# EAGLE schematic WP75xx 2 no usb_v (EAGLE 7.7.0)
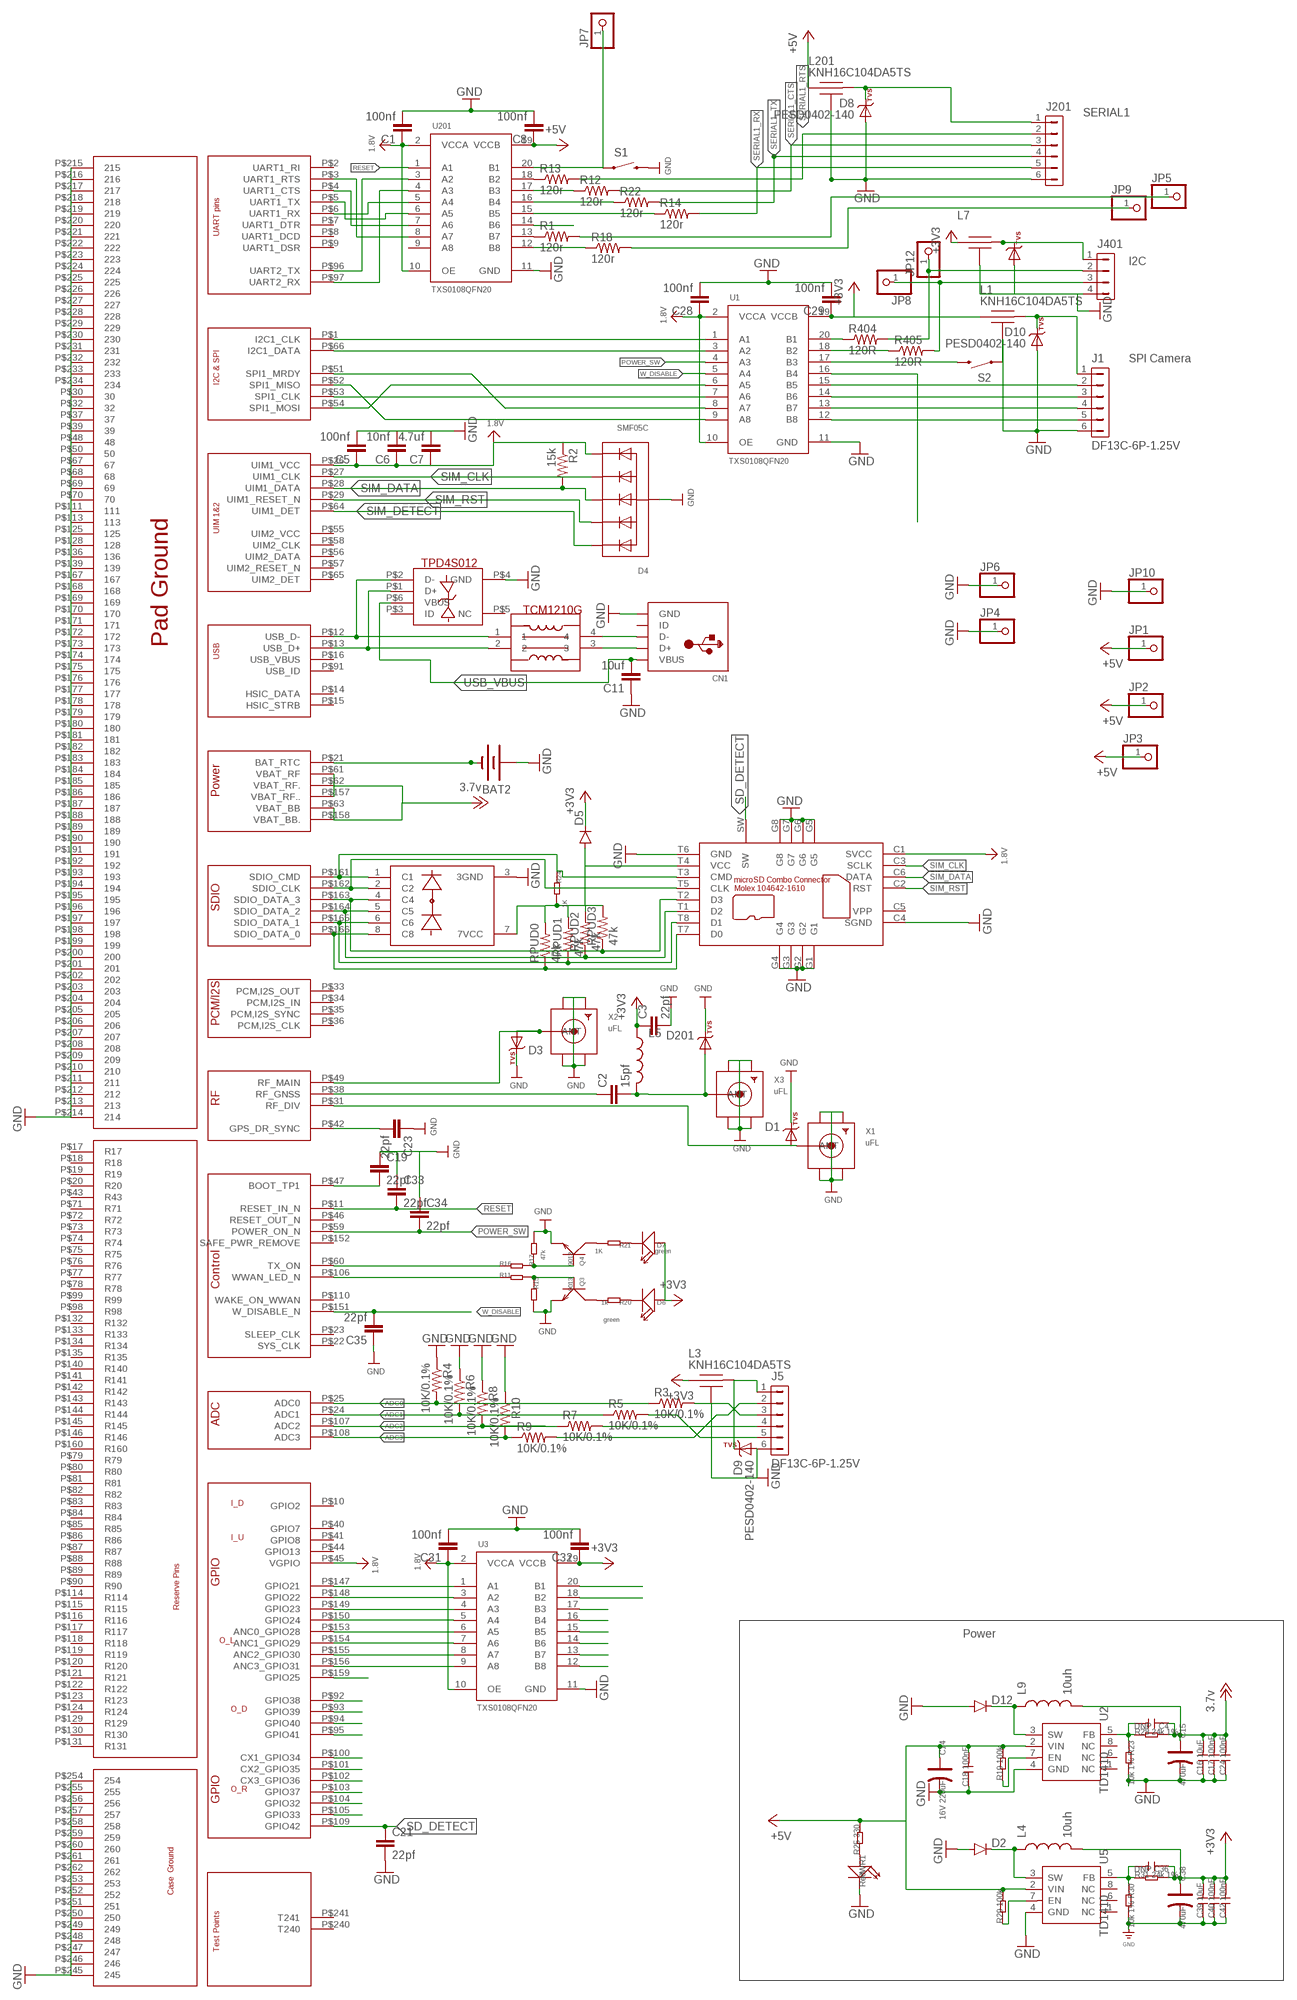
[diagram p0: schematic, sheet 1]

## Parts
BAT2  BATTERY12MM  [BATTCON_12MM]
C1  100nf  1.0UF-25V-+80/-20(0805)"  [0805-CAP]
C2  15pf  0.1UF-25V(+80/-20%)(0603)  [0603-CAP]
C3  22pf  0.1UF-25V(+80/-20%)(0603)  [0603-CAP]
C4  DNP  C-0603  [C0603]
C5  100nf  1.0UF-25V-+80/-20(0805)"  [0805-CAP]
C6  10nf  1.0UF-25V-+80/-20(0805)"  [0805-CAP]
C7  4.7uf  1.0UF-25V-+80/-20(0805)"  [0805-CAP]
C8  100nf  1.0UF-25V-+80/-20(0805)"  [0805-CAP]
C11  10uf  0.1UF-25V(+80/-20%)(0603)  [0603-CAP]
C14  16V 220uF  CAP-ELECTRO-D  [ELECTRO-SMD-D-5.6MM]
C15  470uF  CAP-AVX-D  [AVX-D]
C16  10uF  C-0805  [C0805]
C17  100nF  C-0603  [C0603]
C18  100nF  C-0603  [C0603]
C19  22pf  0.1UF-25V(+80/-20%)(0603)  [0603-CAP]
C21  22pf  0.1UF-25V(+80/-20%)(0603)  [0603-CAP]
C23  22pf  0.1UF-25V(+80/-20%)(0603)  [0603-CAP]
C24  100nF  C-0603  [C0603]
C28  100nf  1.0UF-25V-+80/-20(0805)"  [0805-CAP]
C29  100nf  1.0UF-25V-+80/-20(0805)"  [0805-CAP]
C31  100nf  1.0UF-25V-+80/-20(0805)"  [0805-CAP]
C32  100nf  1.0UF-25V-+80/-20(0805)"  [0805-CAP]
C33  22pf  0.1UF-25V(+80/-20%)(0603)  [0603-CAP]
C34  22pf  0.1UF-25V(+80/-20%)(0603)  [0603-CAP]
C35  22pf  0.1UF-25V(+80/-20%)(0603)  [0603-CAP]
C36  DNP  C-0603  [C0603]
C38  470uF  CAP-AVX-D  [AVX-D]
C39  10uF  C-0805  [C0805]
C40  100nF  C-0603  [C0603]
C42  100nF  C-0603  [C0603]
CN1  USBMINIB  [USB-MINIB]
D1  DIODE-TVS  [0402-TVS]
D2  DIODESMA-KIT  [SMA-DIODE-KIT]
D3  DIODE-TVS  [0402-TVS]
D4  SMF05C  TVSARRAY_5LANE  [SOT363]
D5  DIODESOD123  [SOD-123]
D6  green  LED'0603'  [LED-0603]
D7  green  LED'0603'  [LED-0603]
D8  PESD0402-140  DIODE-TVS  [0402-TVS]
D9  PESD0402-140  DIODE-TVS  [0402-TVS]
D10  PESD0402-140  DIODE-TVS  [0402-TVS]
D12  DIODESMA-KIT  [SMA-DIODE-KIT]
D201  DIODE-TVS  [0402-TVS]
D401  DIODE-TVS  [0402-TVS]
J1  DF13C-6P-1.25V  DF13-6P-1.25V  [DF13C-6P-1.25V]
J5  DF13C-6P-1.25V  DF13-6P-1.25V  [DF13C-6P-1.25V]
J201  DF13-6P-1.25V  [DF13C-6P-1.25V]
J401  DF13-4P-1.25V  [DF13C-4P-1.25V]
JP1  PINHD-1X1  [1X01]
JP2  PINHD-1X1  [1X01]
JP3  PINHD-1X1  [1X01]
JP4  PINHD-1X1  [1X01]
JP5  PINHD-1X1  [1X01]
JP6  PINHD-1X1  [1X01]
JP7  PINHD-1X1  [1X01]
JP8  PINHD-1X1  [1X01]
JP9  PINHD-1X1  [1X01]
JP10  PINHD-1X1  [1X01]
JP12  PINHD-1X1  [1X01]
L1  KNH16C104DA5TS  [KYOCERA-KNH16-DA]
L3  KNH16C104DA5TS  [KYOCERA-KNH16-DA]
L4  10uh  INDUCTOR1210  [1210]
L5  INDUCTOR30OHM,1.8A  [0603]
L7  KNH16C104DA5TS  [KYOCERA-KNH16-DA]
L9  10uh  INDUCTOR1210  [1210]
L201  KNH16C104DA5TS  [KYOCERA-KNH16-DA]
PWR1  Red  007-LED0603  [D0603]
Q3  9013  TRANSISTOR-NPN-SOT23  [SOT23]
Q4  9013  TRANSISTOR-NPN-SOT23  [SOT23]
R1  120r  0.05OHM-1/5W-1%(0603)  [0603]
R2  15k  0.05OHM-1/5W-1%(0603)  [0603]
R3  10K/0.1%  RESISTOR0402-RES  [0402-RES]
R4  10K/0.1%  RESISTOR0402-RES  [0402-RES]
R5  10K/0.1%  RESISTOR0402-RES  [0402-RES]
R6  10K/0.1%  RESISTOR0402-RES  [0402-RES]
R7  10K/0.1%  RESISTOR0402-RES  [0402-RES]
R8  10K/0.1%  RESISTOR0402-RES  [0402-RES]
R9  10K/0.1%  RESISTOR0402-RES  [0402-RES]
R10  10K/0.1%  RESISTOR0402-RES  [0402-RES]
R11  4.7k  R-0603  [R0603]
R12  120r  0.05OHM-1/5W-1%(0603)  [0603]
R13  120r  0.05OHM-1/5W-1%(0603)  [0603]
R14  120r  0.05OHM-1/5W-1%(0603)  [0603]
R15  47k  R-0603  [R0603]
R16  4.7k  R-0603  [R0603]
R17  47k  R-0603  [R0603]
R18  120r  0.05OHM-1/5W-1%(0603)  [0603]
R19  100k  R-0603  [R0603]
R20  1k  R-0603  [R0603]
R21  1K  R-0603  [R0603]
R22  120r  0.05OHM-1/5W-1%(0603)  [0603]
R23  10k 1%  R-0603  [R0603]
R24  1K  R-0603  [R0603]
R25  330  R-0603  [R0603]
R28  24k 1%  R-0603  [R0603]
R29  100k  R-0603  [R0603]
R30  10k 1%  R-0603  [R0603]
R31  24k 1%  R-0603  [R0603]
R404  120R  RESISTOR0402-RES  [0402-RES]
R405  120R  RESISTOR0402-RES  [0402-RES]
RPUD0  47k  0.05OHM-1/5W-1%(0603)  [0603]
RPUD1  47k  0.05OHM-1/5W-1%(0603)  [0603]
RPUD2  47k  0.05OHM-1/5W-1%(0603)  [0603]
RPUD3  47k  0.05OHM-1/5W-1%(0603)  [0603]
S1  SWITCH-MOMENTARY-2SMD-1101NE  [TACTILE-SWITCH-1101NE]
S2  SWITCH-MOMENTARY-2SMD-1101NE  [TACTILE-SWITCH-1101NE]
U1  TXS0108QFN20  [QFN20-RGY]
U2  TD1410  [SOP8]
U3  TXS0108QFN20  [QFN20-RGY]
U5  TD1410  [SOP8]
U201  TXS0108QFN20  [QFN20-RGY]
U$1  SOCKETY_WP75XXX  [SOCKET_WP75XX]
U$11  TCM1210G  [TCM1210G]
U$12  TPD4S012  [TPD4S012]
U$14  SD_SIM_M1610  [SIM_SD_HOLDER]
U$15  PACDN006  [MSOP8]
X1  uFL  SMACONNECTOR_EDGE_UFL  [SMA_EDGELAUNCH_UFL]
X2  uFL  SMACONNECTOR_EDGE_UFL  [SMA_EDGELAUNCH_UFL]
X3  uFL  SMACONNECTOR_EDGE_UFL  [SMA_EDGELAUNCH_UFL]

## Nets
1.8V: C1.1 C5.1 C6.1 C7.1 C28.1 C31.1 D4.6(C5) R2.1 U1.2(VCCA) U1.10(OE) U3.2(VCCA) U3.10(OE) U201.2(VCCA) U201.10(OE) U$1.P$26(UIM1_VCC) U$1.P$45(VGPIO) U$14.C1(SVCC)
3.7V: C4.1 C15.+ C16.2 C17.2 C24.2 L9.2 R28.2 U$1.P$61(VBAT_RF) U$1.P$62(VBAT_RF.) U$1.P$63(VBAT_BB) U$1.P$157(VBAT_RF..) U$1.P$158(VBAT_BB.) ; supply symbol labelled 3.7v
21: U3.1(A1) U$1.P$147(GPIO21)
22: U3.3(A2) U$1.P$148(GPIO22)
23: U3.4(A3) U$1.P$149(GPIO23)
24: U3.5(A4) U$1.P$150(GPIO24)
28: U3.6(A5) U$1.P$153(ANC0_GPIO28)
29: U3.7(A6) U$1.P$154(ANC1_GPIO29)
30: U3.8(A7) U$1.P$155(ANC2_GPIO30)
31: U3.9(A8) U$1.P$156(ANC3_GPIO31)
+3V3: C3.1 C29.1 C32.1 C36.1 C38.+ C39.2 C40.2 C42.2 D5.C D6.+ D7.+ L1.P$1 L3.P$1 L4.2 L5.1 L7.P$1 R31.2 U1.19(VCCB) U3.19(VCCB)
+5V [power]: C8.1 C14.+ C18.2 JP1.1 JP2.1 JP3.1 L201.P$1 R19.2 R25.2 R29.2 U2.2(VIN) U5.2(VIN) U201.19(VCCB)
ADC0: R3.P$1 R4.P$2 U$1.P$25(ADC0)
ADC1: R5.P$1 R6.P$2 U$1.P$24(ADC1)
ADC2: R7.P$1 R8.P$2 U$1.P$107(ADC2)
ADC3: R9.P$1 R10.P$2 U$1.P$108(ADC3)
BAT_RTC: BAT2.GND(-) U$1.P$21(BAT_RTC)
BOOT_TPI: C19.2 U$1.P$47(BOOT_TP1)
D+: U$1.P$13(USB_D+) U$11.2 U$12.P$1(D+)
D-: U$1.P$12(USB_D-) U$11.1 U$12.P$2(D-)
GND: BAT2.PWR@1(+) C1.2 C3.2 C5.2 C6.2 C7.2 C8.2 C11.1 C14.- C15.- C16.1 C17.1 C18.1 C19.1 C21.2 C23.1 C24.1 C28.2 C29.2 C31.2 C32.2 C33.1 C34.1 C35.1 C38.- C39.1 C40.1 C42.1 CN1.GND D1.C D2.A D3.C D4.2(A) D8.A D9.A D10.A D12.A D201.C D401.A J1.6 J5.6 J201.6 J401.4 JP4.1 JP6.1 JP10.1 L1.P$3 L1.P$4 L1.P$5 L3.P$3 L3.P$4 L3.P$5 L7.P$3 L7.P$4 L7.P$5 L201.P$3 L201.P$4 L201.P$5 PWR1.- Q3.2(E) Q4.2(E) R4.P$1 R6.P$1 R8.P$1 R10.P$1 R15.2 R17.2 R23.2 R30.2 S1.2 S2.1 U1.11(GND) U2.4(GND) U3.11(GND) U5.4(GND) U201.11(GND) U$1.P$30 U$1.P$32 U$1.P$37 U$1.P$39 U$1.P$48 U$1.P$50 U$1.P$67 U$1.P$68 U$1.P$69 U$1.P$70 U$1.P$111 U$1.P$113 U$1.P$125 U$1.P$128 U$1.P$136 U$1.P$139 U$1.P$167 U$1.P$168 U$1.P$169 U$1.P$170 U$1.P$171 U$1.P$172 U$1.P$173 U$1.P$174 U$1.P$175 U$1.P$176 U$1.P$177 U$1.P$178 U$1.P$179 U$1.P$180 U$1.P$181 U$1.P$182 U$1.P$183 U$1.P$184 U$1.P$185 U$1.P$186 U$1.P$187 U$1.P$188 U$1.P$189 U$1.P$190 U$1.P$191 U$1.P$192 U$1.P$193 U$1.P$194 U$1.P$195 U$1.P$196 U$1.P$197 U$1.P$198 U$1.P$199 U$1.P$200 U$1.P$201 U$1.P$202 U$1.P$203 U$1.P$204 U$1.P$205 U$1.P$206 U$1.P$207 U$1.P$208 U$1.P$209 U$1.P$210 U$1.P$211 U$1.P$212 U$1.P$213 U$1.P$214 U$1.P$215 U$1.P$216 U$1.P$217 U$1.P$218 U$1.P$219 U$1.P$220 U$1.P$221 U$1.P$222 U$1.P$223 U$1.P$224 U$1.P$225 U$1.P$226 U$1.P$227 U$1.P$228 U$1.P$229 U$1.P$230 U$1.P$231 U$1.P$232 U$1.P$233 U$1.P$234 U$1.P$245 U$1.P$246 U$1.P$247 U$1.P$248 U$1.P$249 U$1.P$250 U$1.P$251 U$1.P$252 U$1.P$253 U$1.P$254 U$1.P$255 U$1.P$256 U$1.P$257 U$1.P$258 U$1.P$259 U$1.P$260 U$1.P$261 U$1.P$262 U$12.P$4(GND) U$14.C4(SGND) U$14.G1 U$14.G2 U$14.G3 U$14.G4 U$14.G5 U$14.G6 U$14.G7 U$14.G8 U$14.T6(GND) U$15.3(3GND) X1.GND@1(GND1) X1.GND@2(GND2) X1.GND@3(GND3) X1.GND@4(GND4) X2.GND@1(GND1) X2.GND@2(GND2) X2.GND@3(GND3) X2.GND@4(GND4) X3.GND@1(GND1) X3.GND@2(GND2) X3.GND@3(GND3) X3.GND@4(GND4)
GPS_ANT: C2.1 U$1.P$38(RF_GNSS)
GPS_SYNC: C23.2 U$1.P$42(GPS_DR_SYNC)
MAIN_ANT: D3.A U$1.P$49(RF_MAIN) X2.P(ANT)
N$1: D9.C J5.1 L3.P$2
N$3: U$1.P$159(GPIO25)
N$4: U3.20(B1)
N$5: CN1.D+ U$11.3
N$6: D5.A R24.2 RPUD0.2 RPUD1.2 RPUD2.2 RPUD3.2 U$14.T4(VCC) U$15.7(7VCC)
N$7: C2.2 D201.A L5.2 X3.P(ANT)
N$9: U3.18(B2)
N$11: J401.2 JP12.1 R404.P$2
N$12: U3.17(B3)
N$13: R24.1 U$1.P$161(SDIO_CMD) U$14.T3(CMD) U$15.1(C1)
N$14: U$1.P$162(SDIO_CLK) U$14.T5(CLK) U$15.2(C2)
N$15: RPUD3.1 U$1.P$163(SDIO_DATA_3) U$14.T2(D3) U$15.4(C4)
N$16: RPUD2.1 U$1.P$164(SDIO_DATA_2) U$14.T1(D2) U$15.5(C5)
N$17: CN1.D- U$11.4
N$18: U3.16(B4)
N$19: RPUD1.1 U$1.P$165(SDIO_DATA_1) U$14.T8(D1) U$15.6(C6)
N$20: RPUD0.1 U$1.P$166(SDIO_DATA_0) U$14.T7(D0) U$15.8(C8)
N$21: U3.15(B5)
N$22: U3.14(B6)
N$23 [power]: D10.C J1.1 L1.P$2
N$25: U3.13(B7)
N$27: U3.12(B8)
N$28: J5.5 R5.P$2
N$29: J5.3 R3.P$2
N$30: J5.4 R7.P$2
N$31: U$1.P$92(GPIO38)
N$32: U$1.P$93(GPIO39)
N$33: U$1.P$94(GPIO40)
N$34: U$1.P$95(GPIO41)
N$35: U$1.P$100(CX1_GPIO34)
N$36: U$1.P$101(CX2_GPIO35)
N$37 [power]: D8.C J201.1 L201.P$2
N$38: Q3.3(C) R20.2
N$39: U$1.P$102(CX3_GPIO36)
N$40: R22.1 U201.16(B4)
N$41: R12.1 U201.17(B3)
N$42: U$1.P$103(GPIO37)
N$43: R13.1 U201.18(B2)
N$44: U$1.P$104(GPIO32)
N$45: U$1.P$105(GPIO33)
N$46: J5.2 R9.P$2
N$47: R14.1 U201.15(B5)
N$48: U1.6(A5) U$1.P$54(SPI1_MOSI)
N$49: U1.7(A6) U$1.P$53(SPI1_CLK)
N$50: U1.9(A8) U$1.P$52(SPI1_MISO)
N$51: U1.8(A7) U$1.P$51(SPI1_MRDY)
N$52: U201.8(A7) U$1.P$3(UART1_RTS)
N$53: J1.5 U1.12(B8)
N$54: S2.2 U1.17(B3)
N$55: U1.16(B4)
N$56: J1.4 U1.13(B7)
N$57: J1.3 U1.14(B6)
N$58: J1.2 U1.15(B5)
N$59: U201.5(A4) U$1.P$6(UART1_RX)
N$60: U201.6(A5) U$1.P$5(UART1_TX)
N$61: U201.7(A6) U$1.P$4(UART1_CTS)
N$62: PWR1.+ R25.1
N$63: JP7.1 S1.1 U201.20(B1)
N$65: U201.14(B6)
N$67: D6.- R20.1
N$68: Q3.1(B) R11.2 R15.1
N$69: Q4.3(C) R21.2
N$70: D7.- R21.1
N$71: Q4.1(B) R16.2 R17.1
N$72: R19.1 U2.7(EN)
N$74: D401.C J401.1 L7.P$2
N$75: D12.C L9.1 U2.3(SW)
N$76: R404.P$1 U1.20(B1)
N$77: R405.P$1 U1.18(B2)
N$79: R1.1 U201.13(B7)
N$80: R18.1 U201.12(B8)
N$81: JP5.1 R1.2
N$82: C4.2 R23.1 R28.1 U2.5(FB)
N$83: R29.1 U5.7(EN)
N$84: D2.C L4.1 U5.3(SW)
N$85: C36.2 R30.1 R31.1 U5.5(FB)
N$89: JP9.1 R18.2
N$90: J401.3 JP8.1 R405.P$2
POWER_SW: C34.2 U1.4(A3) U$1.P$59(POWER_ON_N)
RESET: C33.2 U201.1(A1) U$1.P$11(RESET_IN_N)
RF_DIV: D1.A U$1.P$31(RF_DIV) X1.P(ANT)
RX2: U201.4(A3) U$1.P$97(UART2_RX)
SCL: U1.1(A1) U$1.P$1(I2C1_CLK)
SD_DETECT: C21.1 U$1.P$109(GPIO42) U$14.SW
SDA: U1.3(A2) U$1.P$66(I2C1_DATA)
SERIAL1_CTS: J201.3 R12.2
SERIAL1_RTS: J201.2 R13.2
SERIAL1_RX: J201.5 R14.2
SERIAL1_TX: J201.4 R22.2
SIM_CLK: D4.5(C4) U$1.P$27(UIM1_CLK) U$14.C3(SCLK)
SIM_DATA: D4.4(C3) R2.2 U$1.P$28(UIM1_DATA) U$14.C6(DATA)
SIM_DETECT: D4.1(C1) U$1.P$64(UIM1_DET)
SIM_RST: D4.3(C2) U$1.P$29(UIM1_RESET_N) U$14.C2(RST)
TX2: U201.3(A2) U$1.P$96(UART2_TX)
TX_ACTIVITY: R16.1 U$1.P$60(TX_ON)
USB_VBUS: C11.2 CN1.VBUS U$12.P$6(VBUS)
W_DISABLE: C35.2 U1.5(A4) U$1.P$151(W_DISABLE_N)
WAN_LED: R11.1 U$1.P$106(WWAN_LED_N)
Unconnected: CN1.ID U2.1(NC) U2.6(NC) U2.8(NC) U5.1(NC) U5.6(NC) U5.8(NC) U201.9(A8) U$1.P$2(UART1_RI) U$1.P$7(UART1_DTR) U$1.P$8(UART1_DCD) U$1.P$9(UART1_DSR) U$1.P$10(GPIO2) U$1.P$14(HSIC_DATA) U$1.P$15(HSIC_STRB) U$1.P$16(USB_VBUS) U$1.P$17(R17) U$1.P$18(R18) U$1.P$19(R19) U$1.P$20(R20) U$1.P$22(SYS_CLK) U$1.P$23(SLEEP_CLK) U$1.P$33(PCM,I2S_OUT) U$1.P$34(PCM,I2S_IN) U$1.P$35(PCM,I2S_SYNC) U$1.P$36(PCM,I2S_CLK) U$1.P$40(GPIO7) U$1.P$41(GPIO8) U$1.P$43(R43) U$1.P$44(GPIO13) U$1.P$46(RESET_OUT_N) U$1.P$55(UIM2_VCC) U$1.P$56(UIM2_DATA) U$1.P$57(UIM2_RESET_N) U$1.P$58(UIM2_CLK) U$1.P$65(UIM2_DET) U$1.P$71(R71) U$1.P$72(R72) U$1.P$73(R73) U$1.P$74(R74) U$1.P$75(R75) U$1.P$76(R76) U$1.P$77(R77) U$1.P$78(R78) U$1.P$79(R79) U$1.P$80(R80) U$1.P$81(R81) U$1.P$82(R82) U$1.P$83(R83) U$1.P$84(R84) U$1.P$85(R85) U$1.P$86(R86) U$1.P$87(R87) U$1.P$88(R88) U$1.P$89(R89) U$1.P$90(R90) U$1.P$91(USB_ID) U$1.P$98(R98) U$1.P$99(R99) U$1.P$110(WAKE_ON_WWAN) U$1.P$114(R114) U$1.P$115(R115) U$1.P$116(R116) U$1.P$117(R117) U$1.P$118(R118) U$1.P$119(R119) U$1.P$120(R120) U$1.P$121(R121) U$1.P$122(R122) U$1.P$123(R123) U$1.P$124(R124) U$1.P$129(R129) U$1.P$130(R130) U$1.P$131(R131) U$1.P$132(R132) U$1.P$133(R133) U$1.P$134(R134) U$1.P$135(R135) U$1.P$140(R140) U$1.P$141(R141) U$1.P$142(R142) U$1.P$143(R143) U$1.P$144(R144) U$1.P$145(R145) U$1.P$146(R146) U$1.P$152(SAFE_PWR_REMOVE) U$1.P$160(R160) U$1.P$240(T240) U$1.P$241(T241) U$12.P$3(ID) U$12.P$5(NC) U$14.C5(VPP)

## Notes on the sheet
- SERIAL1
- I2C
- SPI Camera
- Power

## Library data of the parts
BAT2 = SparkFun-Electromechanical:BATTERY: Battery Holders Various common sizes : AA, AAA, 18650 (PRT-12895), 20mm coin cell and 12mm coin cell. 20MM_4LEGS, BATT-10373; PROD_ID: BATT-08044
C1 C5-C8 C28 C29 C31 C32 = SparkFun-Capacitors:1.0UF-25V-+80/-20(0805): CAP-11625
C2 C3 C11 C19 C21 C23 C33-C35 = SparkFun-Capacitors:0.1UF-25V(+80/-20%)(0603): CAP-00810 Ceramic Standard decoupling cap; PROD_ID: CAP-00810; VALUE: 0.1uF
C4 C16-C18 C24 C36 C39 C40 C42 = Discrete:C*: Ceramic Capacitors
C14 C15 C38 = Discrete:CAP*: Electrolytic Capacitors,Tantalum Capacitors and Super Capacitors
CN1 = adafruit:USB: USB Connectors USBMINIB - Surface Mount Female Mini-B USB Connector 4UConnector: 06564 By microbuilder.eu Thru-hole RA Female Mini-B USB Connector 4UConnector: 18732 By ladyada.net
D1 D3 D8-D10 D201 D401 = pixhawk2:DIODE-TVS; PARTNO: PESD0402-140
D2 D5 D12 = SparkFun-DiscreteSemi:DIODE: Diode These are standard reverse protection diodes and small signal diodes. SMA package can handle up to about 1A. SOD-323 can handle about 200mA. What the SOD-323 package when ordering, there are some mfgs out there that are 5-pin packages.
D4 = microbuilder:TVSARRAY_5LANE: Voltage Transient Suppressor Array SOT363 SMF05C - 100W 5V: Digikey - SMF05CT1GOSCT-ND
D6 D7 = Discrete:LED*
J1 J5 J201 = con-hirose-df13:DF13-6P-1.25: DF13-6P 1.25mm Pitch Miniature Crimping Connector.; PARTNO: DF13C-6P-1.25V(20)
J401 = con-hirose-df13:DF13-4P-1.25: DF13-4P 1.25mm Pitch Miniature Crimping Connector.; PARTNO: DF13C-4P-1.25V(20)
JP1-JP10 JP12 = pinhead2:PINHD-1X1: PIN HEADER
L1 L3 L7 L201 = pixhawk2:KNH16C104DA5TS: Kyocera KNH16C104DA5TS EMI filter; PARTNO: KNH16C104DA5TS
L4 L9 = SparkFun-Passives:INDUCTOR: Inductors Basic Inductor/Choke - 0603 and 1206. Footprints are not proven and vary greatly between part numbers. SRN6045- 33uH, 20% 1.4A SDR0403-560KL - 56uH, 10%, 500mA RMS/740mA peak
L5 = SparkFun-Passives:INDUCTOR: Inductors Basic Inductor/Choke - 0603 and 1206. Footprints are not proven and vary greatly between part numbers. SRN6045- 33uH, 20% 1.4A SDR0403-560KL - 56uH, 10%, 500mA RMS/740mA peak; PROD_ID: RES-07859
PWR1 = Discrete:007-LED*
Q3 Q4 = Discrete:TRANSISTOR-NPN*: NPN audion
R1 R2 R12-R14 R18 R22 RPUD0 RPUD1-RPUD3 = SparkFun-Resistors:0.05OHM-1/5W-1%(0603); PROD_ID: RES-12535
R3-R10 = pixhawk2:RESISTOR: Resistor Basic schematic elements and footprints for 0603, 1206, and PTH 1/10th watt (small) resistors.; PARTNO: ERA-2AEB103X
R11 R15-R17 R19-R21 R23-R25 R28-R31 = Discrete:R*
R404 R405 = pixhawk2:RESISTOR: Resistor Basic schematic elements and footprints for 0603, 1206, and PTH 1/10th watt (small) resistors.; PARTNO: RC0402FR-07120RL
S1 S2 = SparkFun-Electromechanical:SWITCH-MOMENTARY-2: Various NO switches- pushbuttons, reed, etc; PROD_ID: SWCH-00815
U1 U3 U201 = pixhawk2:TXS0108; PARTNO: TXS0108ERGYR
U2 U5 = template:TD1410: 2A 380KHz 20V PWM Buck DC/DC Converter
U$1 = sierra wireless:SOCKETY_WP75XXX
U$11 = My_MODULE:TCM1210G
U$12 = My_MODULE:TPD4S012
U$14 = My_MODULE:SD_SIM_M1610
U$15 = My_MODULE:PACDN006
X1-X3 = microbuilder:SMACONNECTOR: SMA Connector 90° DIP SMA Connector, 50 Ohm (4UConnector: 07259)

## Net classes
0 default: width 0.254 mm, clearance 0.254 mm
1 power: width 0.15 mm, drill 0.2 mm, clearance 0.152 mm
3 usbvcc: width 0.508 mm, drill 0.61 mm, clearance 0.254 mm